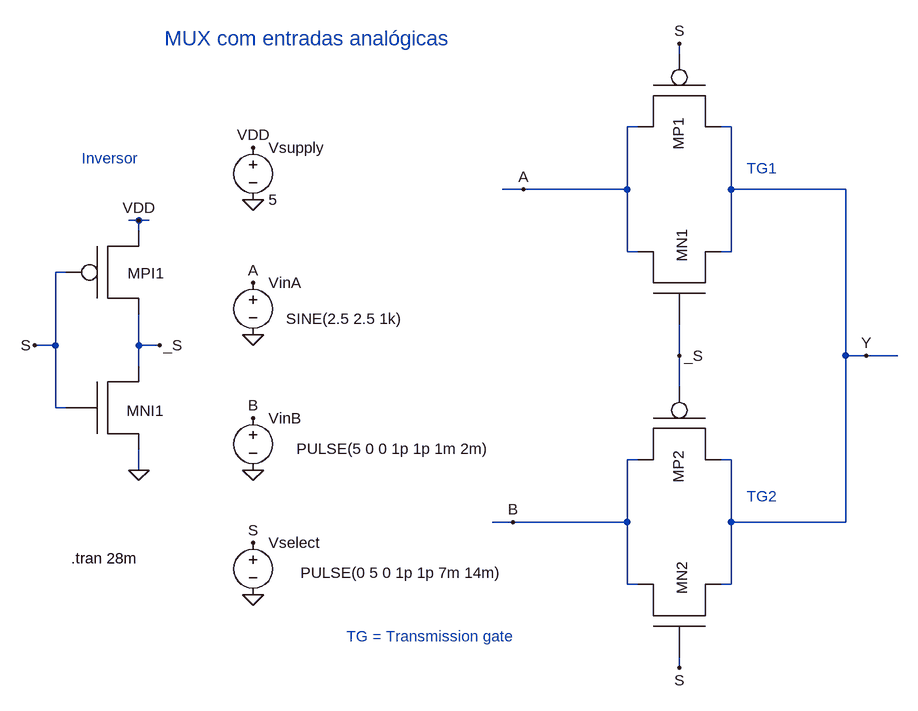
[diagram p0: schematic MUX-analog.asc]
MUX-analog.asc, the LTspice schematic file:
Version 4
SHEET 1 1468 680
WIRE 272 -672 272 -688
WIRE 208 -560 192 -560
WIRE 352 -560 336 -560
WIRE 32 -464 0 -464
WIRE 192 -464 192 -560
WIRE 192 -464 32 -464
WIRE 352 -464 352 -560
WIRE 528 -464 352 -464
WIRE -560 -416 -576 -416
WIRE -544 -416 -560 -416
WIRE -560 -400 -560 -416
WIRE 192 -368 192 -464
WIRE 208 -368 192 -368
WIRE 352 -368 352 -464
WIRE 352 -368 336 -368
WIRE -672 -336 -688 -336
WIRE -688 -224 -688 -336
WIRE -688 -224 -720 -224
WIRE -560 -224 -560 -272
WIRE -528 -224 -560 -224
WIRE 272 -208 272 -256
WIRE 528 -208 528 -464
WIRE 560 -208 528 -208
WIRE 608 -208 560 -208
WIRE -560 -192 -560 -224
WIRE 272 -160 272 -208
WIRE -688 -128 -688 -224
WIRE -672 -128 -688 -128
WIRE 208 -48 192 -48
WIRE 352 -48 336 -48
WIRE -560 -32 -560 -64
WIRE 16 48 -16 48
WIRE 192 48 192 -48
WIRE 192 48 16 48
WIRE 352 48 352 -48
WIRE 528 48 528 -208
WIRE 528 48 352 48
WIRE 192 144 192 48
WIRE 208 144 192 144
WIRE 352 144 352 48
WIRE 352 144 336 144
WIRE 272 272 272 256
FLAG -384 -528 VDD
FLAG -384 -448 0
FLAG -384 -240 0
FLAG -384 -32 0
FLAG -384 160 0
FLAG -384 -320 A
FLAG -384 -112 B
FLAG -384 80 S
FLAG 32 -464 A
FLAG 16 48 B
FLAG 272 -688 S
FLAG 272 272 S
FLAG 272 -208 _S
FLAG 560 -208 Y
FLAG -560 -416 VDD
FLAG -720 -224 S
FLAG -528 -224 _S
FLAG -560 -32 0
SYMBOL voltage -384 -336 R0
WINDOW 3 51 71 Left 2
WINDOW 123 0 0 Left 2
WINDOW 39 0 0 Left 2
SYMATTR Value SINE(2.5 2.5 1k)
SYMATTR InstName VinA
SYMBOL voltage -384 -128 R0
WINDOW 3 67 63 Left 2
WINDOW 123 0 0 Left 2
WINDOW 39 0 0 Left 2
SYMATTR Value PULSE(5 0 0 1p 1p 1m 2m)
SYMATTR InstName VinB
SYMBOL voltage -384 -544 R0
SYMATTR InstName Vsupply
SYMATTR Value 5
SYMBOL voltage -384 64 R0
WINDOW 3 73 62 Left 2
WINDOW 123 0 0 Left 2
WINDOW 39 0 0 Left 2
SYMATTR Value PULSE(0 5 0 1p 1p 7m 14m)
SYMATTR InstName Vselect
SYMBOL PMOSX 288 -592 R90
SYMATTR InstName MP1
SYMBOL NMOSX 256 -336 R270
SYMATTR InstName MN1
SYMBOL PMOSX 288 -80 R90
SYMATTR InstName MP2
SYMBOL NMOSX 256 176 R270
SYMATTR InstName MN2
SYMBOL PMOSX -592 -352 R0
SYMATTR InstName MPI1
SYMBOL NMOSX -592 -144 R0
SYMATTR InstName MNI1
TEXT -664 104 Left 2 !.tran 28m
TEXT -520 -696 Left 3 ;MUX com entradas analógicas
TEXT -240 224 Left 2 ;TG = Transmission gate
TEXT 376 -496 Left 2 ;TG1
TEXT 376 8 Left 2 ;TG2
TEXT -648 -512 Left 2 ;Inversor

The netlist it stands for:
* MUX-analog.asc
VinA A 0 SINE(2.5 2.5 1k)
VinB B 0 PULSE(5 0 0 1p 1p 1m 2m)
Vsupply VDD 0 5
Vselect S 0 PULSE(0 5 0 1p 1p 7m 14m)
XMP1 A S Y PMOSX  ; pins D G S
XMN1 A _S Y NMOSX  ; pins D G S
XMP2 B _S Y PMOSX  ; pins D G S
XMN2 B S Y NMOSX  ; pins D G S
XMPI1 _S S VDD PMOSX  ; pins D G S
XMNI1 _S S 0 NMOSX  ; pins D G S
.tran 28m
* MUX com entradas analógicas
* TG = Transmission gate
* TG1
* TG2
* Inversor
.lib MOS4007.txt
.backanno
.end